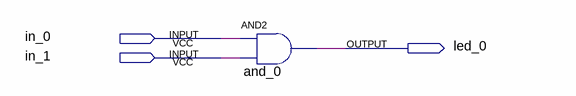
[diagram p0: schematic sheet]
// Quartus schematic GateDemo.bdf as structural Verilog: 1 symbols, 3 pins
module GateDemo (
  input  in_0,
  input  in_1,
  output led_0
);

  and and_0 (led_0, in_0, in_1);
endmodule
